# EasyEDA Pro project chunithm.epro, schematic Schematic2
Create Date: 2023-06-25; Page Name: P1; Project Name: chunithm_psoc; Schematic Name: Schematic2; Update Date: 2023-06-25; Company: 嘉立创EDA; Page Size: A3; Version: V1.0
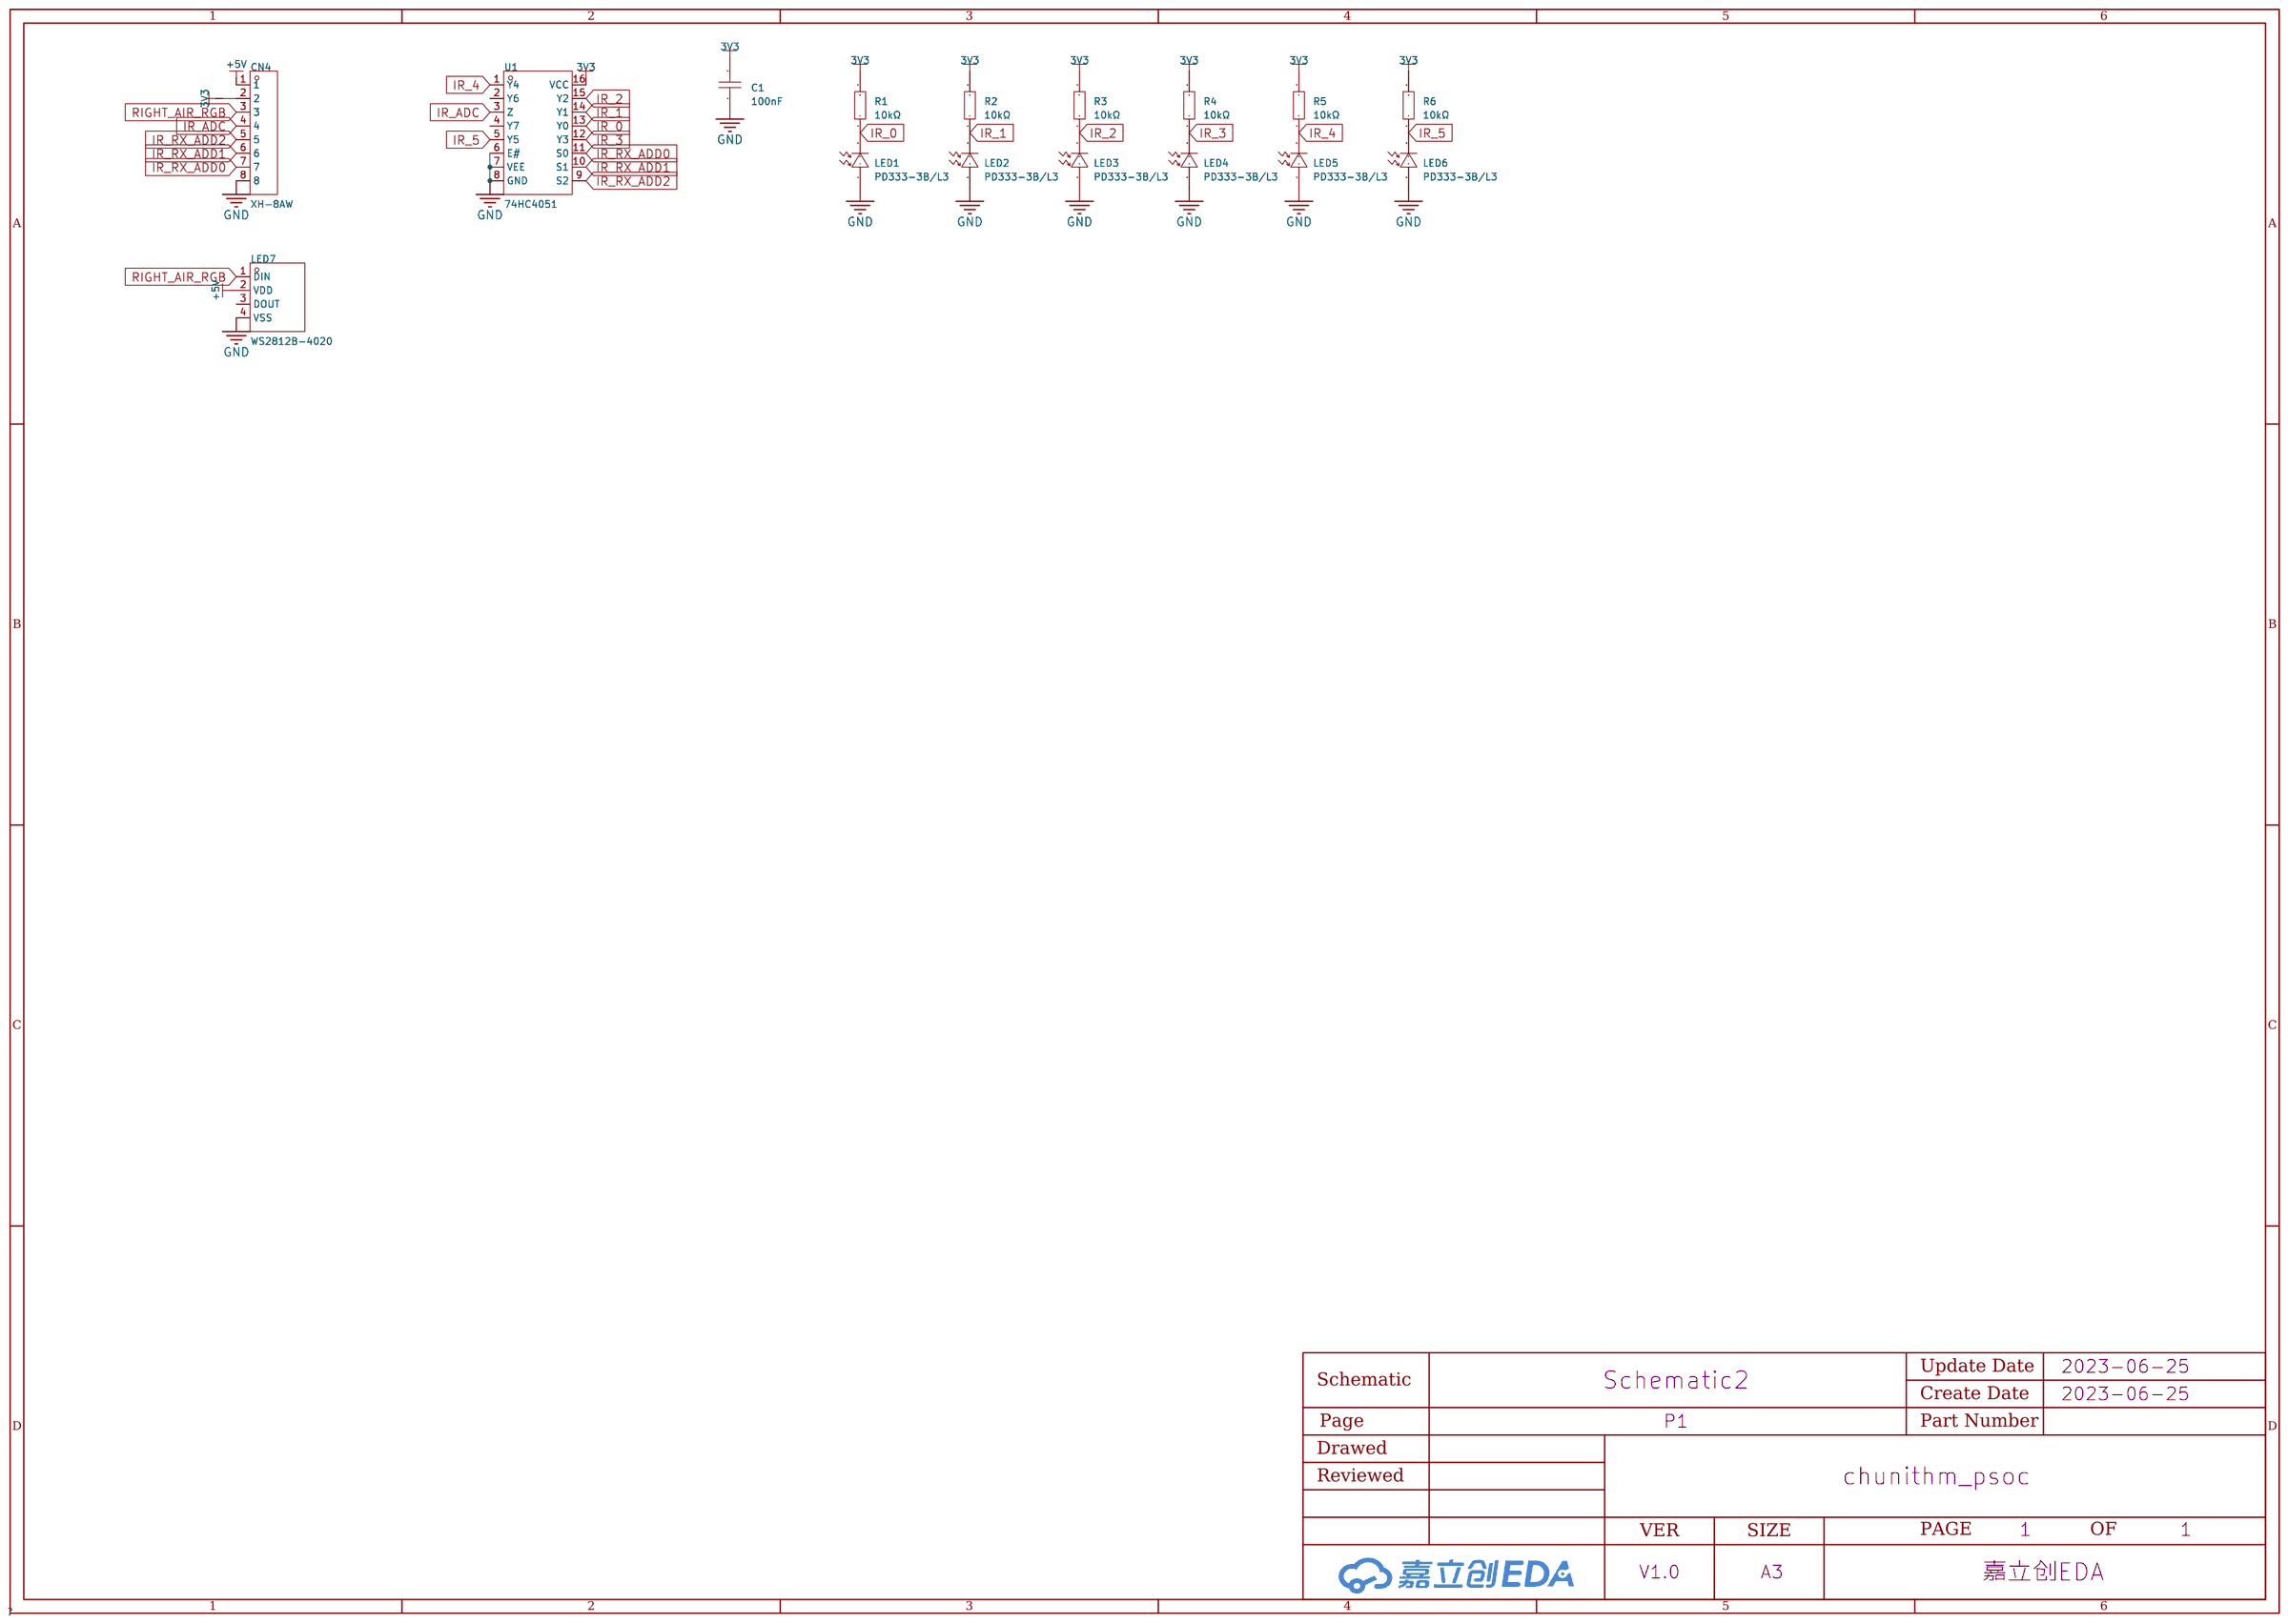
[diagram p2: schematic sheet]

## Parts
C1  100nF  [C0603]
CN4  XH-8AW  [CONN-TH_8P-P2.54_HCTL_XH-8AW_C2908617]
LED1  PD333-3B/L3  [LED-TH_BD5.0-P2.54-RD]
LED2  PD333-3B/L3  [LED-TH_BD5.0-P2.54-RD]
LED3  PD333-3B/L3  [LED-TH_BD5.0-P2.54-RD]
LED4  PD333-3B/L3  [LED-TH_BD5.0-P2.54-RD]
LED5  PD333-3B/L3  [LED-TH_BD5.0-P2.54-RD]
LED6  PD333-3B/L3  [LED-TH_BD5.0-P2.54-RD]
LED7  WS2812B-4020  [LED-SMD_WS2812B-4020]
R1  10kΩ  [R0603]
R2  10kΩ  [R0603]
R3  10kΩ  [R0603]
R4  10kΩ  [R0603]
R5  10kΩ  [R0603]
R6  10kΩ  [R0603]
U1  74HC4051  [SOP-16_L9.9-W3.9-P1.27-LS6.0-BL]

## Library data of the parts
C1 = 0603B104K500NT: 容值:100nF;精度:±10%;额定电压:50V;材质(温度系数):X7R;; LCSC Part Name: 100nF ±10% 50V; Supplier Part: C30926; Manufacturer: FH(风华); Supplier Footprint: 0603; JLCPCB Part Class: Extended Part; Datasheet: https://atta.szlcsc.com/upload/public/pdf/source/20170923/C30926_1506149436298988724.pdf; Supplier: LCSC; Tolerance: ±10%; Voltage Rated: 50V; Temperature Coefficient: X7R
CN4 = XH-8AW: 参考系列:XH;间距:2.54mm;插针结构:1x8P;排数:1;每排PIN数:8;行距:-;公母:公型插针;安装方式:弯插;额定电流:3A;工作温度范围:-25℃~+85℃;; LCSC Part Name: XH 2.54mm 1x8P 弯插; Supplier Part: C2908617; Manufacturer: HCTL(华灿天禄); Supplier Footprint: 弯插,P=2.54mm; JLCPCB Part Class: Extended Part; Datasheet: https://atta.szlcsc.com/upload/public/pdf/source/20211021/ACA2D54D99493880102FCACAC8DAABA8.pdf; Supplier: LCSC; Reference Series: XH; Pitch: 2.54mm; Pins Structure: 1x8P; Number of Rows: 1; Number of PINs Per Row: 8; Gender: 公型插针; Mounting Style: 弯插; Current Rating (Max): 3A; Operating Temperature Range: -25℃~+85℃
LED1-LED6 = PD333-3B/L3: 峰值波长:940nm;响应范围:840nm~1100nm;反向电压:32V;暗电流:10nA;接收角:-;工作温度:-25℃~+85℃;; Supplier Part: C264286; Manufacturer: EVERLIGHT(亿光); Supplier Footprint: 插件,D=5mm; JLCPCB Part Class: Extended Part; Datasheet: https://atta.szlcsc.com/upload/public/pdf/source/20180817/C264286_41586D7DBAE4970C96D82498A26AABA9.pdf; Supplier: LCSC; Peak  Wavelength: 940nm; Spectral Range: 840nm~1100nm; DC Reverse Voltage: 32V; Current Dark: 10nA; Operating Temperature: -25℃~+85℃
LED7 = WS2812B-4020: 发光颜色:RGB三色;二极管配置:-;主波长:465nm~475nm；620nm~625nm；515nm~525nm;色温:-;功率:-;安装方式:-;; LCSC Part Name: RGB三色 （注意防潮，请查阅规格书中对应具体内容）; Supplier Part: C965557; Manufacturer: worldsemi; Supplier Footprint: SMD,2x4mm; JLCPCB Part Class: Extended Part; Datasheet: https://atta.szlcsc.com/upload/public/pdf/source/20201203/C965557_D4D919E14814D6BA44043987D39B5520.pdf; Supplier: LCSC; Emitted Color: RGB三色; Dominant Wavelength: 465nm~475nm；620nm~625nm；515nm~525nm; Forward Current: 12mA
R1-R6 = 0603WAF1002T5E: 电阻类型:厚膜电阻;阻值:10kΩ;精度:±1%;功率:100mW;; LCSC Part Name: 厚膜电阻 10kΩ ±1% 100mW; Supplier Part: C25804; Manufacturer: UNI-ROYAL(厚声); Supplier Footprint: 0603; JLCPCB Part Class: Basic Part; Datasheet: https://atta.szlcsc.com/upload/public/pdf/source/20200306/C422600_1E6D84923E4A46A82E41ADD87F860B5C.pdf; Supplier: LCSC; Type: 厚膜电阻; Tolerance: ±1%; Power(Watts): 100mW; Temperature Coefficient: ±100ppm/℃; Overload Voltage (Max): 75V; Operating Temperature Range: -55℃~+155℃
U1 = 74HC4051: LCSC Part Name: 8路模拟,多路复用器/解复用器; Supplier Part: C2943297; Manufacturer: I-CORE(中微爱芯); Supplier Footprint: SOP-16; JLCPCB Part Class: Extended Part; Datasheet: https://atta.szlcsc.com/upload/public/pdf/source/20220510/C32FF90C2449EAD226E57ADFBC7ACACB.pdf; Supplier: LCSC

## Nets
3V3: C1.2 CN4.2 R1.2 R2.2 R3.2 R4.2 R5.2 R6.2 U1.16(VCC)
+5V: CN4.1 LED7.2(VDD)
GND: C1.1 CN4.8 LED1.1(A) LED2.1(A) LED3.1(A) LED4.1(A) LED5.1(A) LED6.1(A) LED7.4(VSS) U1.6(E#) U1.7(VEE) U1.8(GND)
IR_0: LED1.2(C) R1.1 U1.13(Y0)
IR_1: LED2.2(C) R2.1 U1.14(Y1)
IR_2: LED3.2(C) R3.1 U1.15(Y2)
IR_3: LED4.2(C) R4.1 U1.12(Y3)
IR_4: LED5.2(C) R5.1 U1.1(Y4)
IR_5: LED6.2(C) R6.1 U1.5(Y5)
IR_ADC: CN4.4 U1.3(Z)
IR_RX_ADD0: CN4.7 U1.11(S0)
IR_RX_ADD1: CN4.6 U1.10(S1)
IR_RX_ADD2: CN4.5 U1.9(S2)
RIGHT_AIR_RGB: CN4.3 LED7.1(DIN)

Not connected (* = marked no-connect by the designer): LED7 3(DOUT); U1 2(Y6) 4(Y7)
